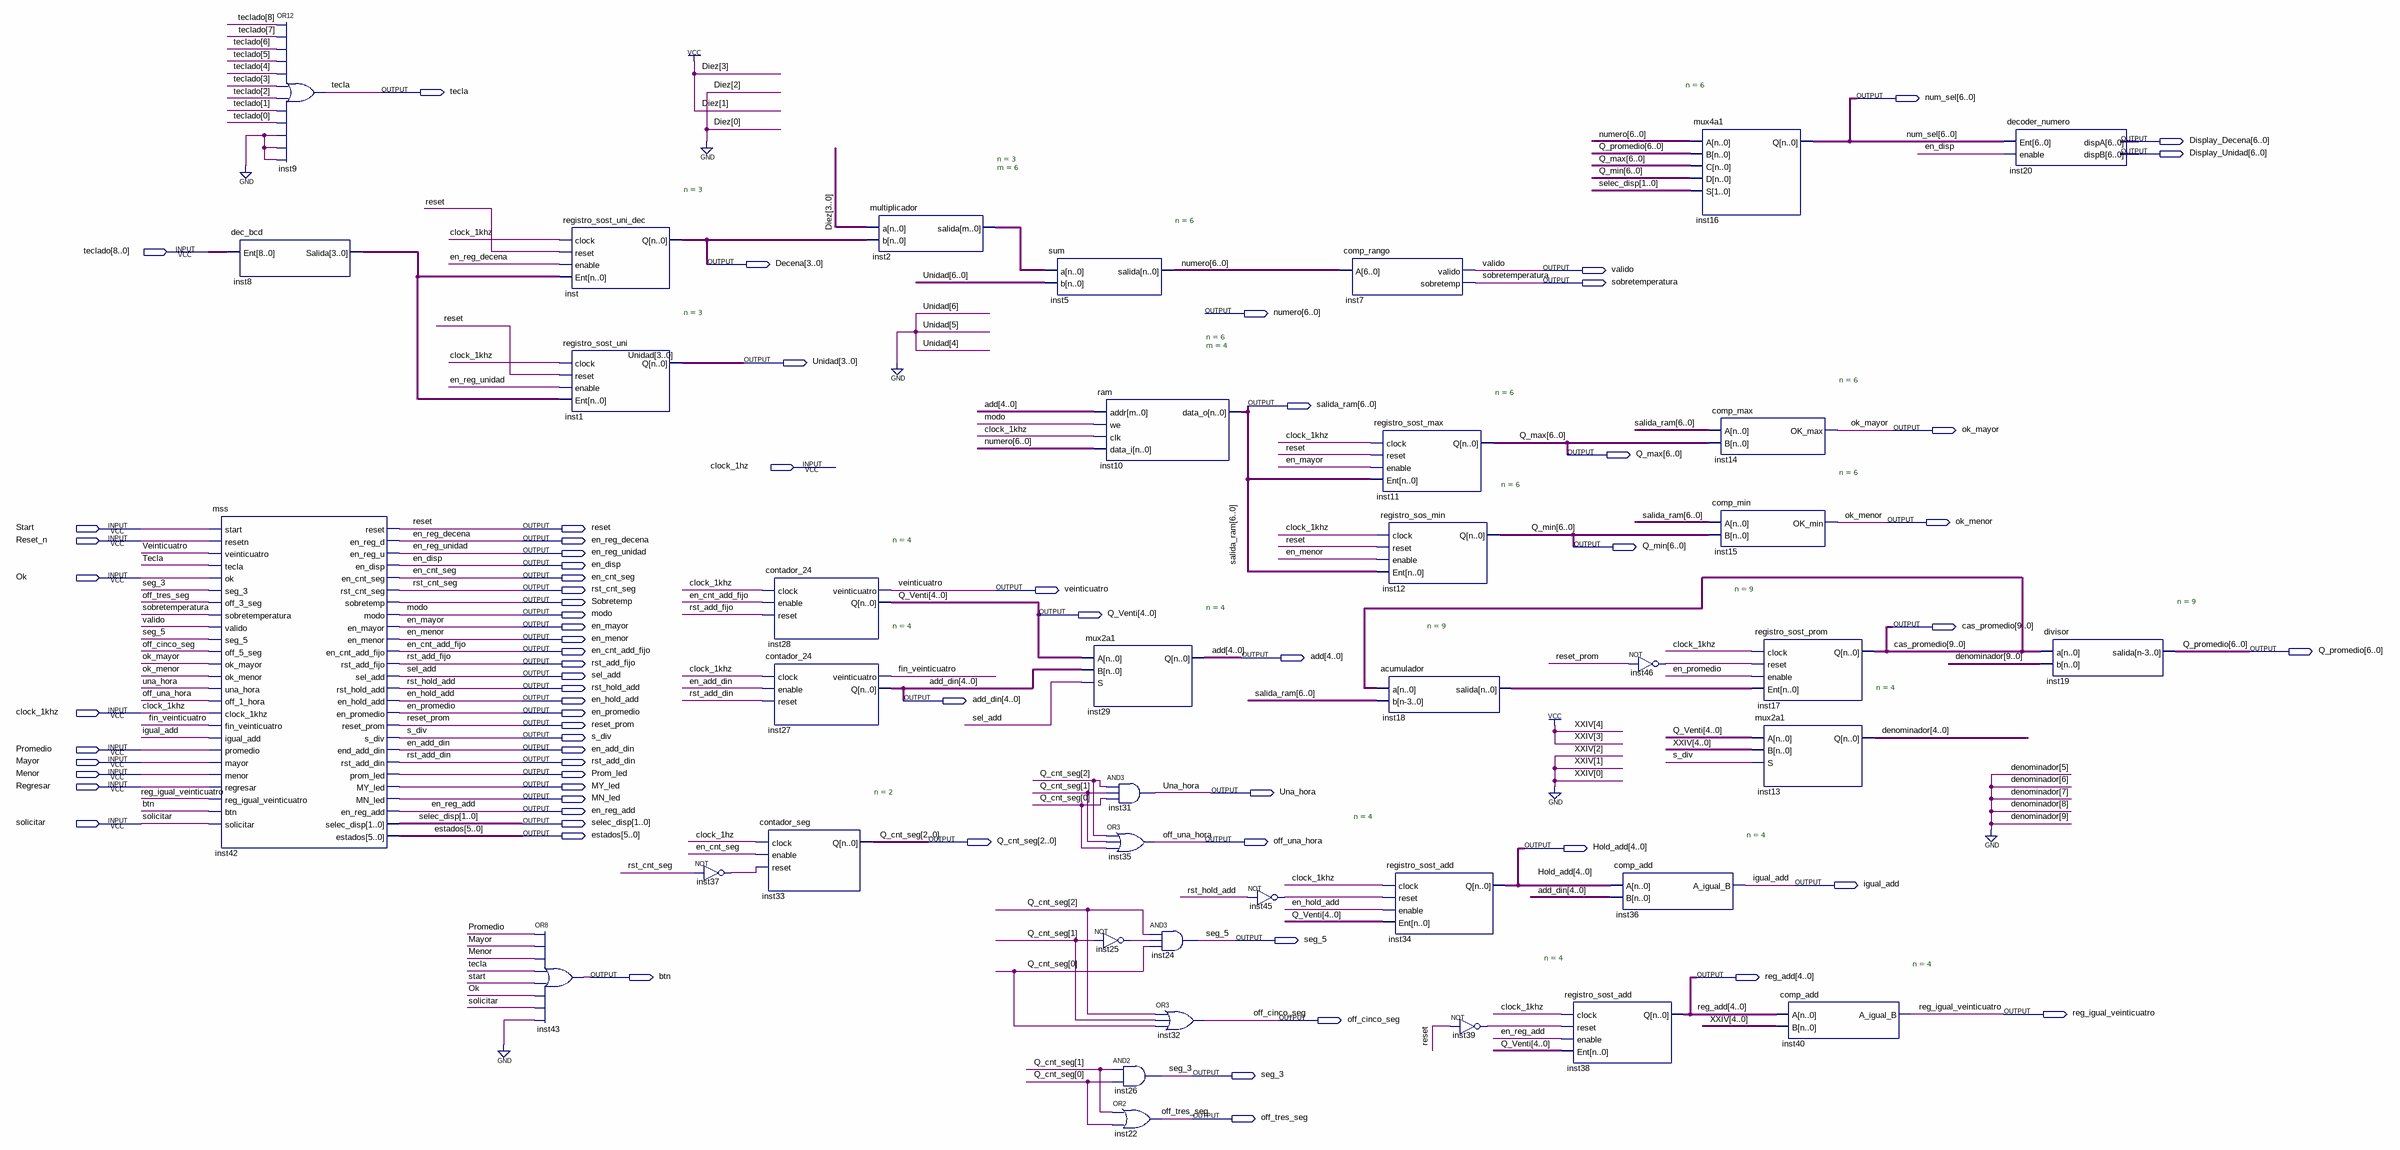
[diagram p0: schematic sheet]
// Quartus schematic PROYECTO_SIMULACION.bdf as structural Verilog: 39 symbols, 69 pins
module PROYECTO_SIMULACION (
  input  [8:0] teclado,
  input  clock_1hz,
  input  Start,
  input  Reset_n,
  input  Ok,
  input  clock_1khz,
  input  Promedio,
  input  Mayor,
  input  Menor,
  input  Regresar,
  input  solicitar,
  output tecla,
  output [6:0] num_sel,
  output [6:0] Display_Decena,
  output [6:0] Display_Unidad,
  output [3:0] Decena,
  output valido,
  output sobretemperatura,
  output [6:0] numero,
  output [3:0] Unidad,
  output [6:0] salida_ram,
  output ok_mayor,
  output [6:0] Q_max,
  output ok_menor,
  output reset,
  output en_reg_decena,
  output [6:0] Q_min,
  output en_reg_unidad,
  output en_disp,
  output en_cnt_seg,
  output rst_cnt_seg,
  output veinticuatro,
  output Sobretemp,
  output modo,
  output [4:0] Q_Venti,
  output en_mayor,
  output [9:0] cas_promedio,
  output en_menor,
  output en_cnt_add_fijo,
  output [6:0] Q_promedio,
  output [4:0] add,
  output rst_add_fijo,
  output sel_add,
  output rst_hold_add,
  output en_hold_add,
  output [4:0] add_din,
  output en_promedio,
  output reset_prom,
  output s_div,
  output en_add_din,
  output rst_add_din,
  output Prom_led,
  output MY_led,
  output Una_hora,
  output MN_led,
  output en_reg_add,
  output [1:0] selec_disp,
  output [5:0] estados,
  output [2:0] Q_cnt_seg,
  output off_una_hora,
  output [4:0] Hold_add,
  output igual_add,
  output seg_5,
  output btn,
  output [4:0] reg_add,
  output reg_igual_veinticuatro,
  output off_cinco_seg,
  output seg_3,
  output off_tres_seg
);

  wire fin_veinticuatro, inst25_out, inst37_out, inst39_out, inst45_out, inst46_out;
  wire [3:0] inst8_salida;
  wire [4:0] denominador;
  wire [6:0] inst2_salida;
  wire [9:0] inst18_salida;

  dec_bcd inst8 (.Ent(teclado), .Salida(inst8_salida));
  mss inst42 (
    .start(Start), .resetn(Reset_n), .veinticuatro(veinticuatro), .tecla(tecla), .ok(Ok), .seg_3(seg_3),
    .off_3_seg(off_tres_seg), .sobretemperatura(sobretemperatura), .valido(valido), .seg_5(seg_5),
    .off_5_seg(off_cinco_seg), .ok_mayor(ok_mayor), .ok_menor(ok_menor), .una_hora(Una_hora),
    .off_1_hora(off_una_hora), .clock_1khz(clock_1khz), .fin_veinticuatro(fin_veinticuatro),
    .igual_add(igual_add), .promedio(Promedio), .mayor(Mayor), .menor(Menor), .regresar(Regresar),
    .reg_igual_veinticuatro(reg_igual_veinticuatro), .btn(btn), .solicitar(solicitar), .reset(reset),
    .en_reg_d(en_reg_decena), .en_reg_u(en_reg_unidad), .en_disp(en_disp), .en_cnt_seg(en_cnt_seg),
    .rst_cnt_seg(rst_cnt_seg), .sobretemp(Sobretemp), .modo(modo), .en_mayor(en_mayor), .en_menor(en_menor),
    .en_cnt_add_fijo(en_cnt_add_fijo), .rst_add_fijo(rst_add_fijo), .sel_add(sel_add),
    .rst_hold_add(rst_hold_add), .en_hold_add(en_hold_add), .en_promedio(en_promedio),
    .reset_prom(reset_prom), .s_div(s_div), .end_add_din(en_add_din), .rst_add_din(rst_add_din),
    .prom_led(Prom_led), .MY_led(MY_led), .MN_led(MN_led), .en_reg_add(en_reg_add), .selec_disp(selec_disp),
    .estados(estados));
  or inst9 (tecla, teclado[8], teclado[7], teclado[6], teclado[5], teclado[4], teclado[3], teclado[2], teclado[1], teclado[0], 1'b0, 1'b0, 1'b0);
  registro_sost_uni_dec #(.n(3)) inst (
    .clock(clock_1khz), .reset(reset), .enable(en_reg_decena), .Ent(inst8_salida), .Q(Decena));
  registro_sost_uni #(.n(3)) inst1 (
    .clock(clock_1khz), .reset(reset), .enable(en_reg_unidad), .Ent(inst8_salida), .Q(Unidad));
  or inst43 (btn, Promedio, Mayor, Menor, tecla, Start, Ok, solicitar, 1'b0);
  not inst37 (inst37_out, rst_cnt_seg);
  contador_24 #(.n(4)) inst28 (
    .clock(clock_1khz), .enable(en_cnt_add_fijo), .reset(rst_add_fijo), .veinticuatro(veinticuatro),
    .Q(Q_Venti));
  contador_24 #(.n(4)) inst27 (
    .clock(clock_1khz), .enable(en_add_din), .reset(rst_add_din), .veinticuatro(fin_veinticuatro), .Q(add_din));
  contador_seg #(.n(2)) inst33 (.clock(clock_1hz), .enable(en_cnt_seg), .reset(inst37_out), .Q(Q_cnt_seg));
  multiplicador #(.n(3), .m(6)) inst2 (.a(4'b1010), .b(Decena), .salida(inst2_salida));
  sum #(.n(6)) inst5 (.a(inst2_salida), .b({3'b000, Unidad}), .salida(numero));
  ram #(.n(6), .m(4)) inst10 (.addr(add), .we(modo), .clk(clock_1khz), .data_i(numero), .data_o(salida_ram));
  mux2a1 #(.n(4)) inst29 (.A(Q_Venti), .B(add_din), .S(sel_add), .Q(add));
  and inst31 (Una_hora, Q_cnt_seg[2], Q_cnt_seg[1], Q_cnt_seg[0]);
  or inst35 (off_una_hora, Q_cnt_seg[2], Q_cnt_seg[1], Q_cnt_seg[0]);
  not inst25 (inst25_out, Q_cnt_seg[1]);
  and inst26 (seg_3, Q_cnt_seg[1], Q_cnt_seg[0]);
  or inst22 (off_tres_seg, Q_cnt_seg[1], Q_cnt_seg[0]);
  and inst24 (seg_5, Q_cnt_seg[2], inst25_out, Q_cnt_seg[0]);
  or inst32 (off_cinco_seg, Q_cnt_seg[2], Q_cnt_seg[1], Q_cnt_seg[0]);
  not inst45 (inst45_out, rst_hold_add);
  comp_rango inst7 (.A(numero), .valido(valido), .sobretemp(sobretemperatura));
  registro_sost_max #(.n(6)) inst11 (.clock(clock_1khz), .reset(reset), .enable(en_mayor), .Ent(salida_ram), .Q(Q_max));
  registro_sos_min #(.n(6)) inst12 (.clock(clock_1khz), .reset(reset), .enable(en_menor), .Ent(salida_ram), .Q(Q_min));
  acumulador #(.n(9)) inst18 (.a(cas_promedio), .b(salida_ram), .salida(inst18_salida));
  registro_sost_add #(.n(4)) inst34 (
    .clock(clock_1khz), .reset(inst45_out), .enable(en_hold_add), .Ent(Q_Venti), .Q(Hold_add));
  not inst39 (inst39_out, reset);
  registro_sost_add #(.n(4)) inst38 (
    .clock(clock_1khz), .reset(inst39_out), .enable(en_reg_add), .Ent(Q_Venti), .Q(reg_add));
  not inst46 (inst46_out, reset_prom);
  comp_add #(.n(4)) inst36 (.A(Hold_add), .B(add_din), .A_igual_B(igual_add));
  mux4a1 #(.n(6)) inst16 (.A(numero), .B(Q_promedio), .C(Q_max), .D(Q_min), .S(selec_disp), .Q(num_sel));
  comp_max #(.n(6)) inst14 (.A(salida_ram), .B(Q_max), .OK_max(ok_mayor));
  comp_min #(.n(6)) inst15 (.A(salida_ram), .B(Q_min), .OK_min(ok_menor));
  registro_sost_prom #(.n(9)) inst17 (
    .clock(clock_1khz), .reset(inst46_out), .enable(en_promedio), .Ent(inst18_salida), .Q(cas_promedio));
  mux2a1 #(.n(4)) inst13 (.A(Q_Venti), .B(5'b11000), .S(s_div), .Q(denominador));
  comp_add #(.n(4)) inst40 (.A(reg_add), .B(5'b11000), .A_igual_B(reg_igual_veinticuatro));
  decoder_numero inst20 (.Ent(num_sel), .enable(en_disp), .dispA(Display_Decena), .dispB(Display_Unidad));
  divisor #(.n(9)) inst19 (.a(cas_promedio), .b({{5{1'b0}}, denominador}), .salida(Q_promedio));
endmodule
